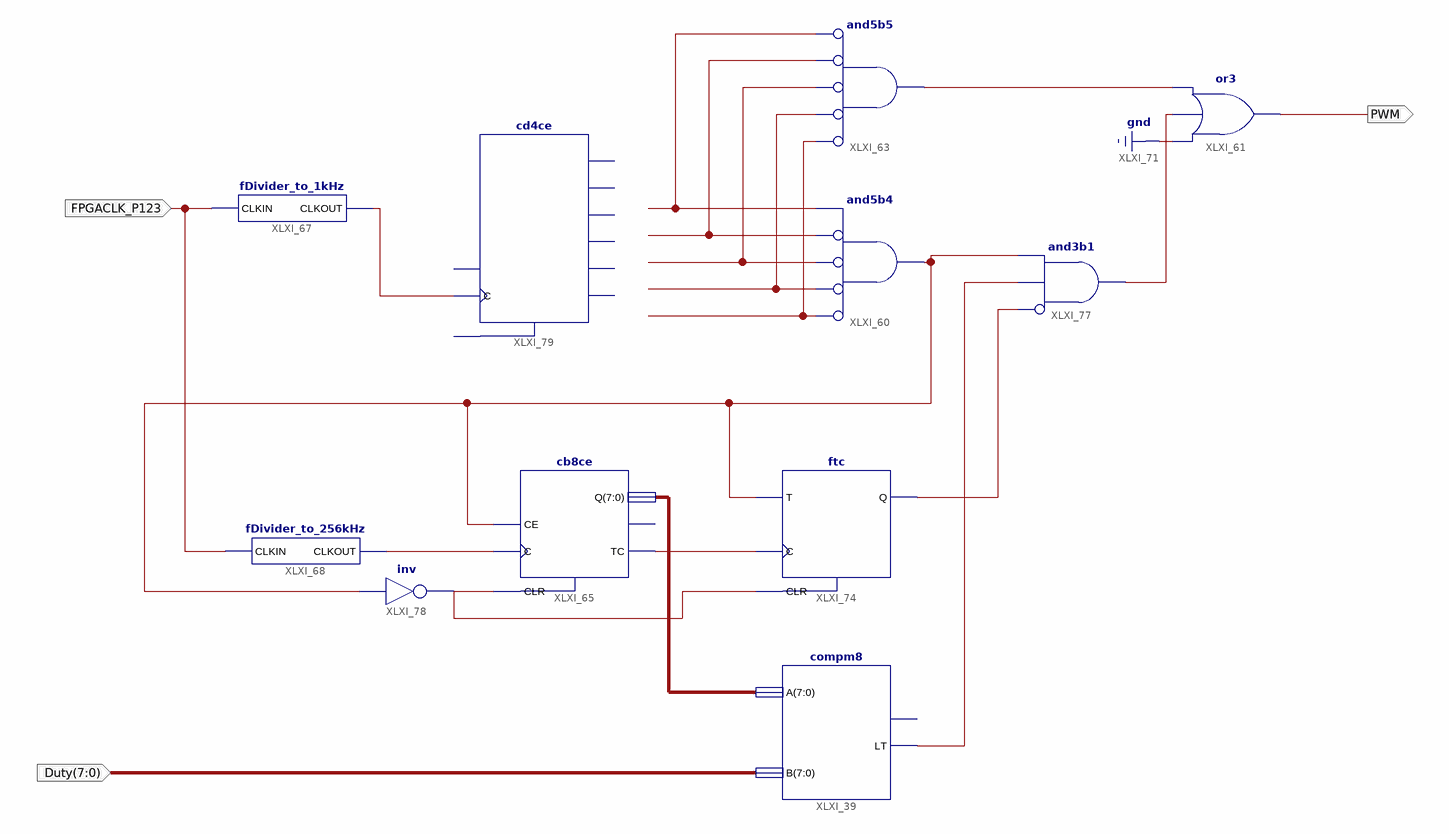
[diagram p0: schematic sheet 1]
// Xilinx ISE schematic PWM_Generator.sch (spartan6) as structural Verilog: 11 symbols, 3 ports
module PWM_Generator (
  input  FPGACLK_P123,
  input  [7:0] Duty,
  output PWM
);

  wire XLXN_94, XLXN_95, XLXN_96, XLXN_97, XLXN_98, XLXN_99, XLXN_116, XLXN_121, XLXN_130, XLXN_132,
       XLXN_134, XLXN_138, XLXN_139, XLXN_140;
  wire [7:0] XLXN_50;

  and XLXI_60 (XLXN_134, ~XLXN_98, ~XLXN_97, ~XLXN_96, ~XLXN_95, XLXN_94);  // and5b4
  or XLXI_61 (PWM, 1'b0, XLXN_121, XLXN_99);
  and XLXI_63 (XLXN_99, ~XLXN_98, ~XLXN_97, ~XLXN_96, ~XLXN_95, ~XLXN_94);  // and5b5
  compm8 XLXI_39 (.A(XLXN_50), .B(Duty), .LT(XLXN_138));  // open: GT
  cb8ce XLXI_65 (.C(XLXN_130), .CE(XLXN_134), .CLR(XLXN_116), .Q(XLXN_50), .TC(XLXN_132));  // open: CEO
  fDivider_to_1kHz XLXI_67 (.CLKIN(FPGACLK_P123), .CLKOUT(XLXN_140));
  fDivider_to_256kHz XLXI_68 (.CLKIN(FPGACLK_P123), .CLKOUT(XLXN_130));
  ftc XLXI_74 (.C(XLXN_132), .CLR(XLXN_116), .T(XLXN_134), .Q(XLXN_139));
  and XLXI_77 (XLXN_121, ~XLXN_139, XLXN_138, XLXN_134);  // and3b1
  not XLXI_78 (XLXN_116, XLXN_134);
  cd4ce XLXI_79 (.C(XLXN_140));  // open: CE, CLR, CEO, Q0, Q1, Q2, Q3, TC
endmodule
